# EAGLE design Serial Load Cell converter (EAGLE 7.2.0)
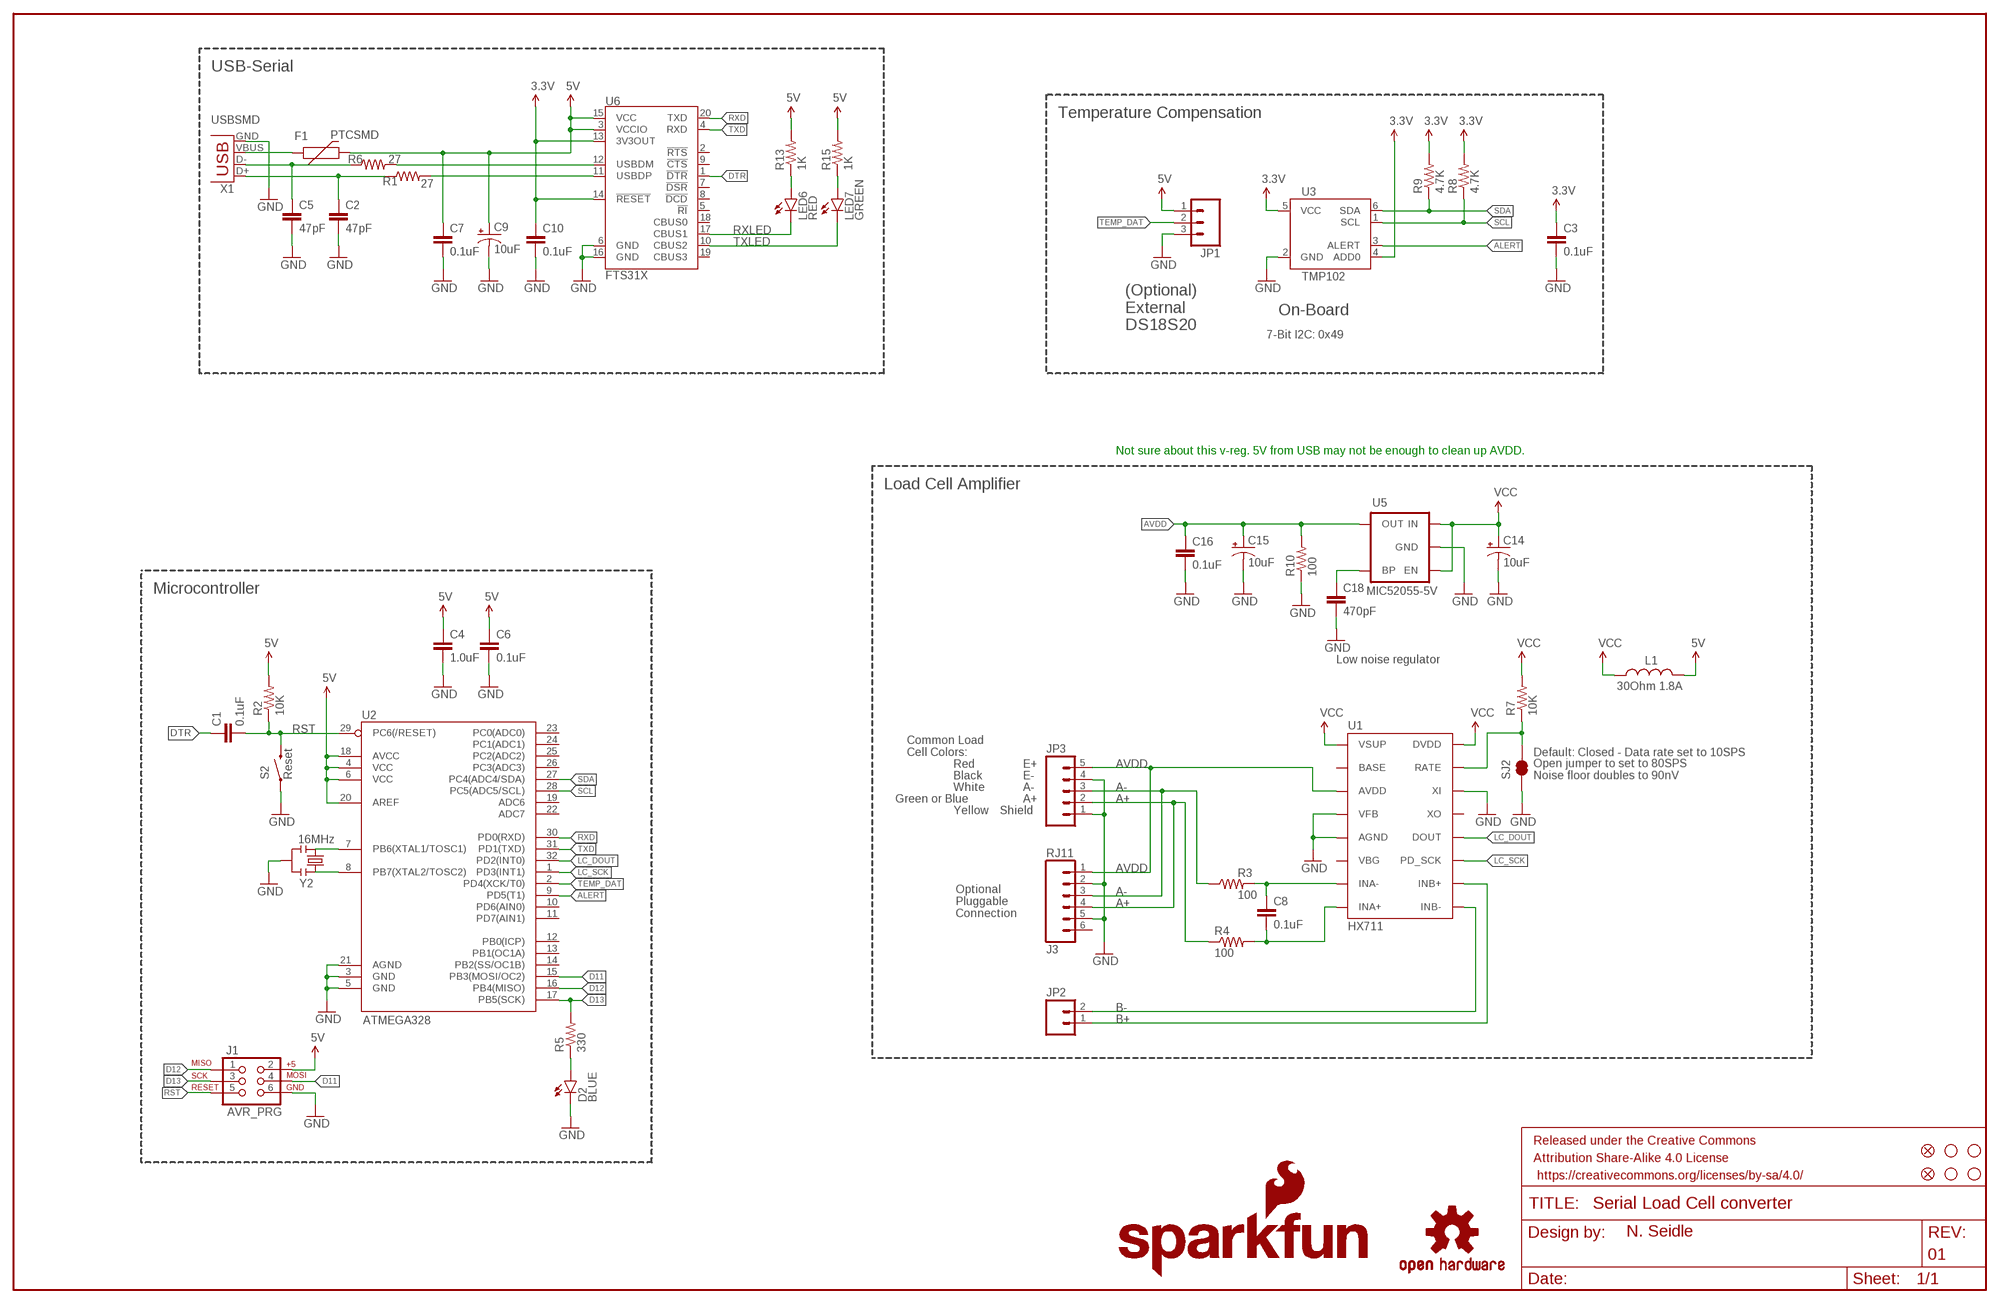
[diagram p0: schematic, sheet 1]

## Parts
C1  0.1uF  0.1UF-25V(+80/-20%)(0603)  [0603-CAP]
C2  47pF  47PF-50V-5%(0603)  [0603-CAP]
C3  0.1uF  0.1UF-25V-5%(0603)  [0603-CAP]
C4  1.0uF  1.0UF-16V-10%(0603)  [0603-CAP]
C5  47pF  47PF-50V-5%(0603)  [0603-CAP]
C6  0.1uF  0.1UF-25V(+80/-20%)(0603)  [0603-CAP]
C7  0.1uF  0.1UF-25V(+80/-20%)(0603)  [0603-CAP]
C8  0.1uF  0.1UF-25V-5%(0603)  [0603-CAP]
C9  10uF  10UF-16V-10%(TANT)  [EIA3216]
C10  0.1uF  0.1UF-25V(+80/-20%)(0603)  [0603-CAP]
C14  10uF  10UF-16V-10%(TANT)  [EIA3216]
C15  10uF  10UF-16V-10%(TANT)  [EIA3216]
C16  0.1uF  0.1UF-25V-5%(0603)  [0603-CAP]
C18  470pF  470PF-50V-5%(0603)SMD  [0603-CAP]
D2  BLUE  LED-BLUE1206  [LED-1206]
F1  PTCSMD  [PTC-1206]
FID1  FIDUCIAL1X2  [FIDUCIAL-1X2]
FID2  FIDUCIAL1X2  [FIDUCIAL-1X2]
FRAME1  FRAME-LEDGER  [CREATIVE_COMMONS]
J1  AVR_PRG  AVR_SPI_PRG_6PTH  [2X3]
J3  RJ11  RJ11-6PTH  [RJ11-6]
JP1  M03PTH  [1X03]
JP2  M02PTH  [1X02]
JP3  M05PTH  [1X05]
L1  30Ohm 1.8A  INDUCTOR30OHM,1.8A  [0603]
LED6  RED  LED-RED1206  [LED-1206]
LED7  GREEN  LED-GREENLARGE  [LED-1206]
LOGO1  SFE_LOGO_NAME_FLAME.1_INCH  [SFE_LOGO_NAME_FLAME_.1]
LOGO2  OSHW-LOGOS  [OSHW-LOGO-S]
LOGO4  SFE_LOGO_NAME_FLAME.1_INCH  [SFE_LOGO_NAME_FLAME_.1]
R1  27  27OHM1/10W1%(0603)  [0603]
R2  10K  10KOHM-1/10W-1%(0603)0603  [0603-RES]
R3  100  100OHM-1/10W-1%(0603)  [0603-RES]
R4  100  100OHM-1/10W-1%(0603)  [0603-RES]
R5  330  330OHM1/10W1%(0603)  [0603-RES]
R6  27  27OHM1/10W1%(0603)  [0603]
R7  10K  10KOHM-1/10W-1%(0603)0603  [0603-RES]
R8  4.7K  4.7KOHM-1/10W-1%(0603)  [0603-RES]
R9  4.7K  4.7KOHM-1/10W-1%(0603)  [0603-RES]
R10  100  100OHM-1/10W-1%(0603)  [0603-RES]
R13  1K  1KOHM-1/10W-1%(0603)  [0603-RES]
R15  1K  1KOHM-1/10W-1%(0603)  [0603-RES]
S2  Reset  SWITCH-MOMENTARY-2SMD  [TACTILE-SWITCH-SMD]
SJ2  JUMPER-PAD-2-NC_BY_TRACE  [PAD-JUMPER-2-NC_BY_TRACE_YES_SILK]
STANDOFF1  STAND-OFF  [STAND-OFF]
STANDOFF2  STAND-OFF  [STAND-OFF]
STANDOFF3  STAND-OFF  [STAND-OFF]
STANDOFF4  STAND-OFF  [STAND-OFF]
U1  HX711  HX711HX711  [SO16]
U2  ATMEGA328  ATMEGA328_SMT  [TQFP32-08]
U3  TMP102  [SOT563]
U5  MIC52055-5V  MIC52055V  [SOT23-5]
U6  FTS31X  FT231XS  [SSOP20_L]
X1  USBSMD  [USB-MINIB]
Y2  16MHz  RESONATOR16MHZ  [RESONATOR-SMD]

## Nets
3.3V [power]: C3.1 C10.1 R8.2 R9.2 U3.4(ADD0) U3.5(VCC) U6.13(3V3OUT) U6.14(!RESET)
5V: C4.1 C6.1 C7.1 C9.A(+) F1.2 J1.2 JP1.1 L1.2 R2.2 R13.2 R15.2 U2.4(VCC) U2.6(VCC) U2.18(AVCC) U2.20(AREF) U6.3(VCCIO) U6.15(VCC)
A+: J3.4 JP3.2 R4.1
A-: J3.3 JP3.3 R3.1
ALERT: U2.9(PD5(T1)) U3.3(ALERT)
AVDD: C15.A(+) C16.1 J3.1 JP3.5 R10.2 U1.3(AVDD) U5.5(OUT)
B+: JP2.1 U1.10(INB+)
B-: JP2.2 U1.9(INB-)
D11: J1.4 U2.15(PB3(MOSI/OC2))
D12: J1.1 U2.16(PB4(MISO))
D13: J1.3 R5.2 U2.17(PB5(SCK))
DTR: C1.1 U6.1(!DTR)
GND [power]: C2.2 C3.2 C4.2 C5.2 C6.2 C7.2 C9.C(-) C10.2 C14.C(-) C15.C(-) C16.2 C18.2 D2.C J1.6 J3.2 J3.5 JP1.3 JP3.1 JP3.4 R10.1 S2.1 SJ2.1 U1.4(VFB) U1.5(AGND) U1.14(XI) U2.3(GND) U2.5(GND) U2.21(AGND) U3.2(GND) U5.2(GND) U6.6(GND) U6.16(GND) X1.GND Y2.2
LC_DOUT: U1.12(DOUT) U2.32(PD2(INT0))
LC_SCK: U1.11(PD_SCK) U2.1(PD3(INT1))
N$1: U2.7(PB6(XTAL1/TOSC1)) Y2.1
N$2: D2.A R5.1
N$3: U2.8(PB7(XTAL2/TOSC2)) Y2.3
N$4: C5.1 R6.1 X1.D-
N$5: LED6.A R13.1
N$6: LED7.A R15.1
N$7: C2.1 R1.1 X1.D+
N$8: R6.2 U6.12(USBDM)
N$9: R7.1 SJ2.2 U1.15(RATE)
N$10: C8.1 R3.2 U1.7(INA-)
N$11: C8.2 R4.2 U1.8(INA+)
N$12: F1.1 X1.VBUS
N$13: R1.2 U6.11(USBDP)
N$15: C18.1 U5.4(BP)
RST: C1.2 J1.5 R2.1 S2.3 U2.29(PC6(/RESET))
RXD: U2.30(PD0(RXD)) U6.20(TXD)
RXLED: LED6.C U6.17(CBUS1)
SCL: R8.1 U2.28(PC5(ADC5/SCL)) U3.1(SCL)
SDA: R9.1 U2.27(PC4(ADC4/SDA)) U3.6(SDA)
TEMP_DAT: JP1.2 U2.2(PD4(XCK/T0))
TXD: U2.31(PD1(TXD)) U6.4(RXD)
TXLED: LED7.C U6.10(CBUS2)
VCC: C14.A(+) L1.1 R7.2 U1.1(VSUP) U1.16(DVDD) U5.1(IN) U5.3(EN)
Unconnected: J3.6 U1.2(BASE) U1.6(VBG) U1.13(XO) U2.10(PD6(AIN0)) U2.11(PD7(AIN1)) U2.12(PB0(ICP)) U2.13(PB1(OC1A)) U2.14(PB2(SS/OC1B)) U2.19(ADC6) U2.22(ADC7) U2.23(PC0(ADC0)) U2.24(PC1(ADC1)) U2.25(PC2(ADC2)) U2.26(PC3(ADC3)) U6.2(!RTS) U6.5(!RI) U6.7(!DSR) U6.8(!DCD) U6.9(!CTS) U6.18(CBUS0) U6.19(CBUS3)

## Notes on the sheet
- USB-Serial
- Temperature Compensation
- On-Board
- (Optional)
  External
  DS18S20
- 7-Bit I2C: 0x49
- Not sure about this v-reg. 5V from USB may not be enough to clean up AVDD.
- Load Cell Amplifier
- Microcontroller
- Low noise regulator
- Common Load
  Cell Colors:
- Default: Closed - Data rate set to 10SPS
- Red | E+
- Black | E-
- Open jumper to set to 80SPS
  Noise floor doubles to 90nV
- White | A-
- Green or Blue | A+
- Yellow | Shield
- Optional
  Pluggable
  Connection

## Library data of the parts
C1 C6 C7 C10 = SparkFun-Capacitors:0.1UF-25V(+80/-20%)(0603): CAP-00810 Ceramic Standard decoupling cap; PROD_ID: CAP-00810
C2 C5 = SparkFun-Capacitors:47PF-50V-5%(0603): CAP-08913; PROD_ID: CAP-08913
C3 C8 C16 = SparkFun-Capacitors:0.1UF-25V-5%(0603): CAP-08604; PROD_ID: CAP-08604
C4 = SparkFun-Capacitors:1.0UF-16V-10%(0603): CAP-00868; PROD_ID: CAP-00868
C9 C14 C15 = SparkFun-Capacitors:10UF-16V-10%(TANT): CAP-00811 1206/EIA-3216 Tantalum capacitor; PROD_ID: CAP-00811
C18 = SparkFun-Capacitors:470PF-50V-5%(0603): CAP-07884; PROD_ID: CAP-07884
D2 = SparkFun-LED:LED-BLUE: Blue LEDs for production use Various blue LEDs stocked by SparkFun production 0603 - DIO-08575 Rebel - DIO-09553 1206 - DIO-09911; PROD_ID: DIO-09911
F1 = SparkFun-PowerIC:PTC: Resettable Fuse PTC Resettable Fuse. Spark Fun Electronics SKU : COM-08357; PROD_ID: RES-11150
FID1 FID2 = SparkFun-Aesthetics:FIDUCIAL: Fiducial Alignment Points Various fiducial points for machine vision alignment.
FRAME1 = SparkFun-Aesthetics:FRAME-LEDGER: Schematic Frame Standard 11x14 US Ledger frame; DESIGNER: N. Seidle; VERSION: 01
J1 = SparkFun-Connectors:AVR_SPI_PRG_6: AVR ISP 6 Pin This is the reduced ISP connector for AVR programming. Common on Arduino. This footprint will take up less PCB space and can be used with a 10-pin to 6-pin adapter such as SKU: BOB-08508 **Special note about "TEST_POINT" package. The stop mask is on the top side, so if you want your programming test points to be on the bottom of your board, make sure to place this package on the bottom side of the board. This also ensure that the orientation to program from the bottom side will be correct.
J3 = SparkFun-Connectors:RJ11-6: RJ11 Jack Simple 6 pin RJ11 jack. Commonly found on CAT3 devices and Microchip programmers. SKU: PRT-00132; PROD_ID: CONN-08590
JP1 = SparkFun-Connectors:M03: Header 3 Standard 3-pin 0.1" header. Use with straight break away headers (SKU : PRT-00116), right angle break away headers (PRT-00553), swiss pins (PRT-00743), machine pins (PRT-00117), and female headers (PRT-00115). Molex polarized connector foot print use with SKU : PRT-08232 with associated crimp pins and housings.
JP2 = SparkFun-Connectors:M02: Standard 2-pin 0.1" header. Use with - straight break away headers ( PRT-00116) - right angle break away headers (PRT-00553) - swiss pins (PRT-00743) - machine pins (PRT-00117) - female headers (PRT-00115) Molex polarized connector foot print use with: PRT-08233 with associated crimp pins and housings. 2.54_SCREWTERM for use with PRT-10571. 3.5mm Screw Terminal footprints for PRT-08084 5mm Screw Terminal footprints for use with PRT-08432
JP3 = SparkFun-Connectors:M05: Header 5 Standard 5-pin 0.1" header. Use with straight break away headers (SKU : PRT-00116), right angle break away headers (PRT-00553), swiss pins (PRT-00743), machine pins (PRT-00117), and female headers (PRT-00115). Molex polarized connector foot print use with SKU : PRT-08230 with associated crimp pins and housings.
L1 = SparkFun-Passives:INDUCTOR: Inductors Basic Inductor/Choke - 0603 and 1206. Footprints are not proven and vary greatly between part numbers. SRN6045- 33uH, 20% 1.4A SDR0403-560KL - 56uH, 10%, 500mA RMS/740mA peak; PROD_ID: RES-07859
LED6 = SparkFun-LED:LED-RED: Assorted Red LEDs LilyPad 1206- DIO-09912 1206- DIO-00809 0603- DIO-00819; PROD_ID: DIO-00809
LED7 = SparkFun-LED:LED-GREEN: Various green LEDs Green LEDs used in SFE Production 0603- DIO-00821 LARGE- DIO-00862 LILYPAD- DIO-09910; PROD_ID: DIO-00862
LOGO1 LOGO4 = SparkFun-Aesthetics:SFE_LOGO_NAME_FLAME: SFE Logo, name and flame This is the SparkFun full logo. The logo on the schematic will always be the same size; the package variant is the height of the flame part of the logo. Default layer for the logo on the board is tSilk.
LOGO2 = SparkFun-Aesthetics:OSHW-LOGO: Open Source Hardware Logo This logo indicates the piece of hardware it is found on incorporates a OSHW license and/or adheres to the definition of open source hardware found here: http://freedomdefined.org/OSHW
R1 R6 = SparkFun-Resistors:27OHM1/10W1%(0603): RES-09334; PROD_ID: RES-09334
R2 R7 = SparkFun-Resistors:10KOHM-1/10W-1%(0603): RES-00824; PROD_ID: RES-00824
R3 R4 R10 = SparkFun-Resistors:100OHM-1/10W-1%(0603): RES-07863; PROD_ID: RES-07863
R5 = SparkFun-Resistors:330OHM1/10W1%(0603): RES-00818; PROD_ID: RES-00818
R8 R9 = SparkFun-Resistors:4.7KOHM-1/10W-1%(0603): RES-07857; PROD_ID: RES-07857
R13 R15 = SparkFun-Resistors:1KOHM-1/10W-1%(0603): RES-07856; PROD_ID: RES-07856
S2 = SparkFun-Electromechanical:SWITCH-MOMENTARY-2: Various NO switches- pushbuttons, reed, etc; PROD_ID: SWCH-08247
SJ2 = SparkFun-Passives:JUMPER-PAD-2-NC_BY_TRACE
STANDOFF1-STANDOFF4 = SparkFun-Electromechanical:STAND-OFF: #4 Stand Off This is the mechanical footprint for a #4 phillips button head screw. Use the keepout ring to avoid running the screw head into surrounding components. SKU : PRT-00447
U1 = Testing:HX711; PROD_ID: IC-12445
U2 = SparkFun-DigitalIC:ATMEGA328_SMT: 32-Pin Atmega328 part Commonly used on Arduino compatible boards Available in QFP and QFN packages TQFP is IC-09069 QFN is non-stock; PROD_ID: IC-09069; VALUE: ATMEGA328P
U3 = SparkFun-Sensors:TMP102: I2C degC temp sensor; PROD_ID: IC-09303
U5 = SparkFun-PowerIC:MIC5205: MIC5205 150mA vreg 3.3V - VREG-00822 5V - VREG-00823; PROD_ID: VREG-00823
U6 = SparkFun-DigitalIC:FT231X: FTDI FT231X Full Speed USB to Full-handshake UART This USB2.0 Full Speed IC offers a compact bridge to full handshake UART interfaces. The device is a UART, capable of operating up to 3MBaud, with low power consumption (8mA). The FT231X includes the complete FT-X series feature set and enables USB to be added into a system design quickly and easily over a UART interface.; PROD_ID: IC-11524; VALUE: FTS31XS-U
X1 = SparkFun-Connectors:USB: USB Connectors USB-B-PTH is fully proven SKU : PRT-00139/CONN-08278 USB-miniB is fully proven SKU : PRT-00587 USB-A-PCB is untested. USB-A-H is throughly reviewed, but untested. Spark Fun Electronics SKU : PRT-00437 USB-B-SMT is throughly reviewed, but untested. Needs silkscreen touching up. USB-A-S has not been used/tested USB-MB-H has not been used/tested USB-MICROB has been used. CONN-09505; PROD_ID: CONN-08193
Y2 = SparkFun-FreqCtrl:RESONATOR: Resonator Small SMD resonator. Used, eg, on the Arduino Pro/ Pro Mini boards. 8MHz- XTAL-08895 16MHz- XTAL-08900; PROD_ID: XTAL-08900; VALUE: 16MHZ

## Net classes
1 power: width 0.203 mm

## Board
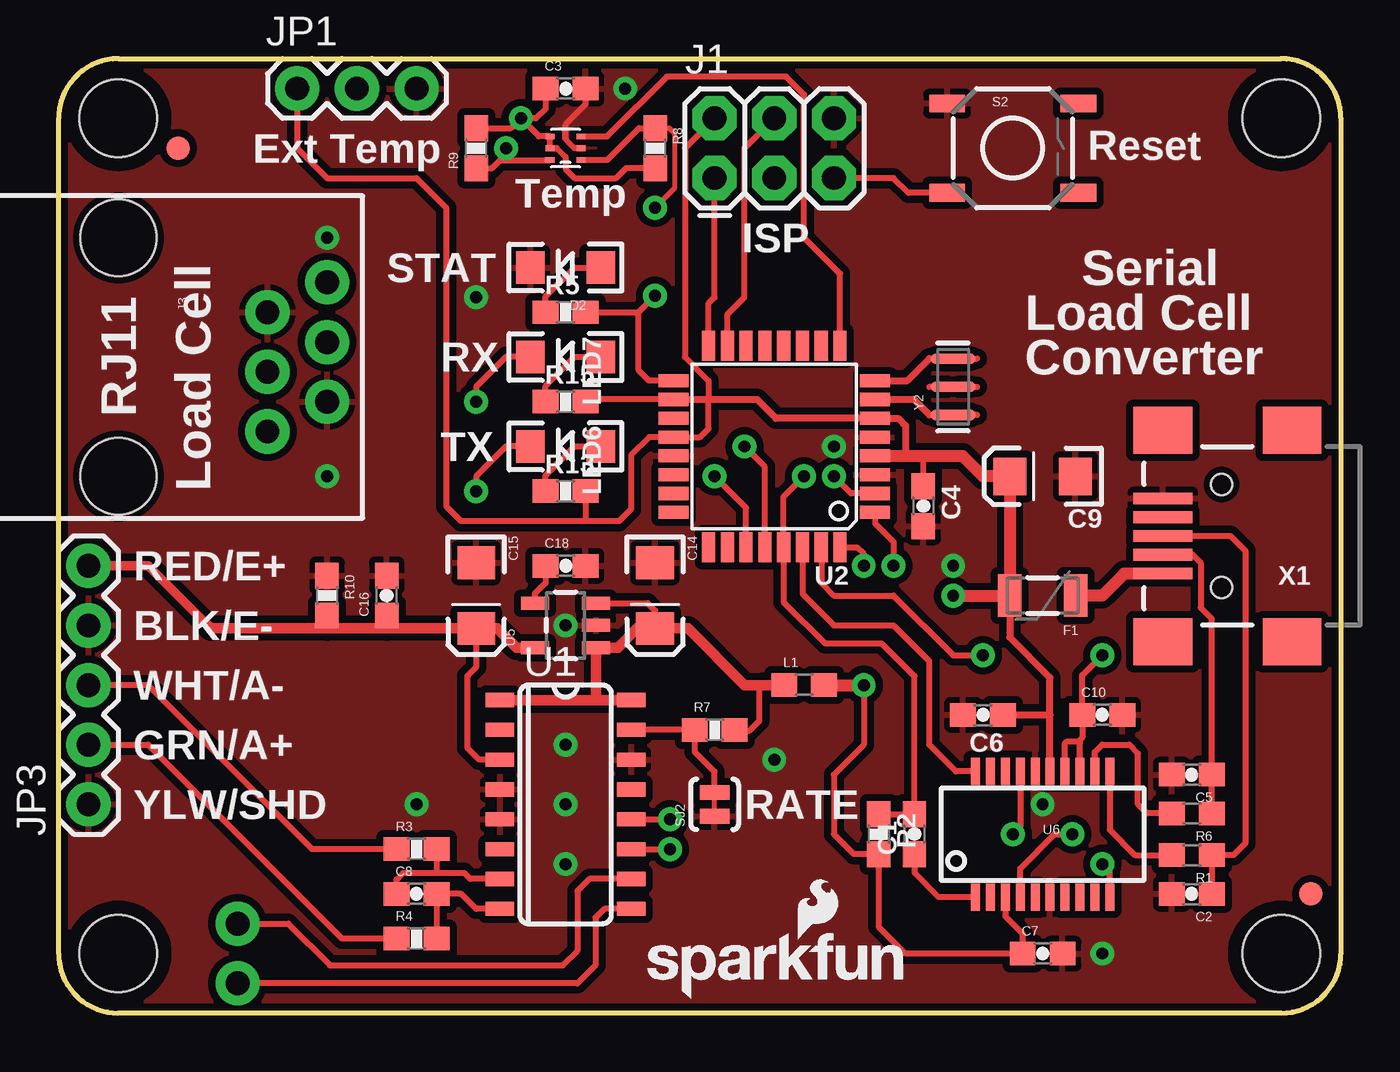
[diagram p1: board, top side]
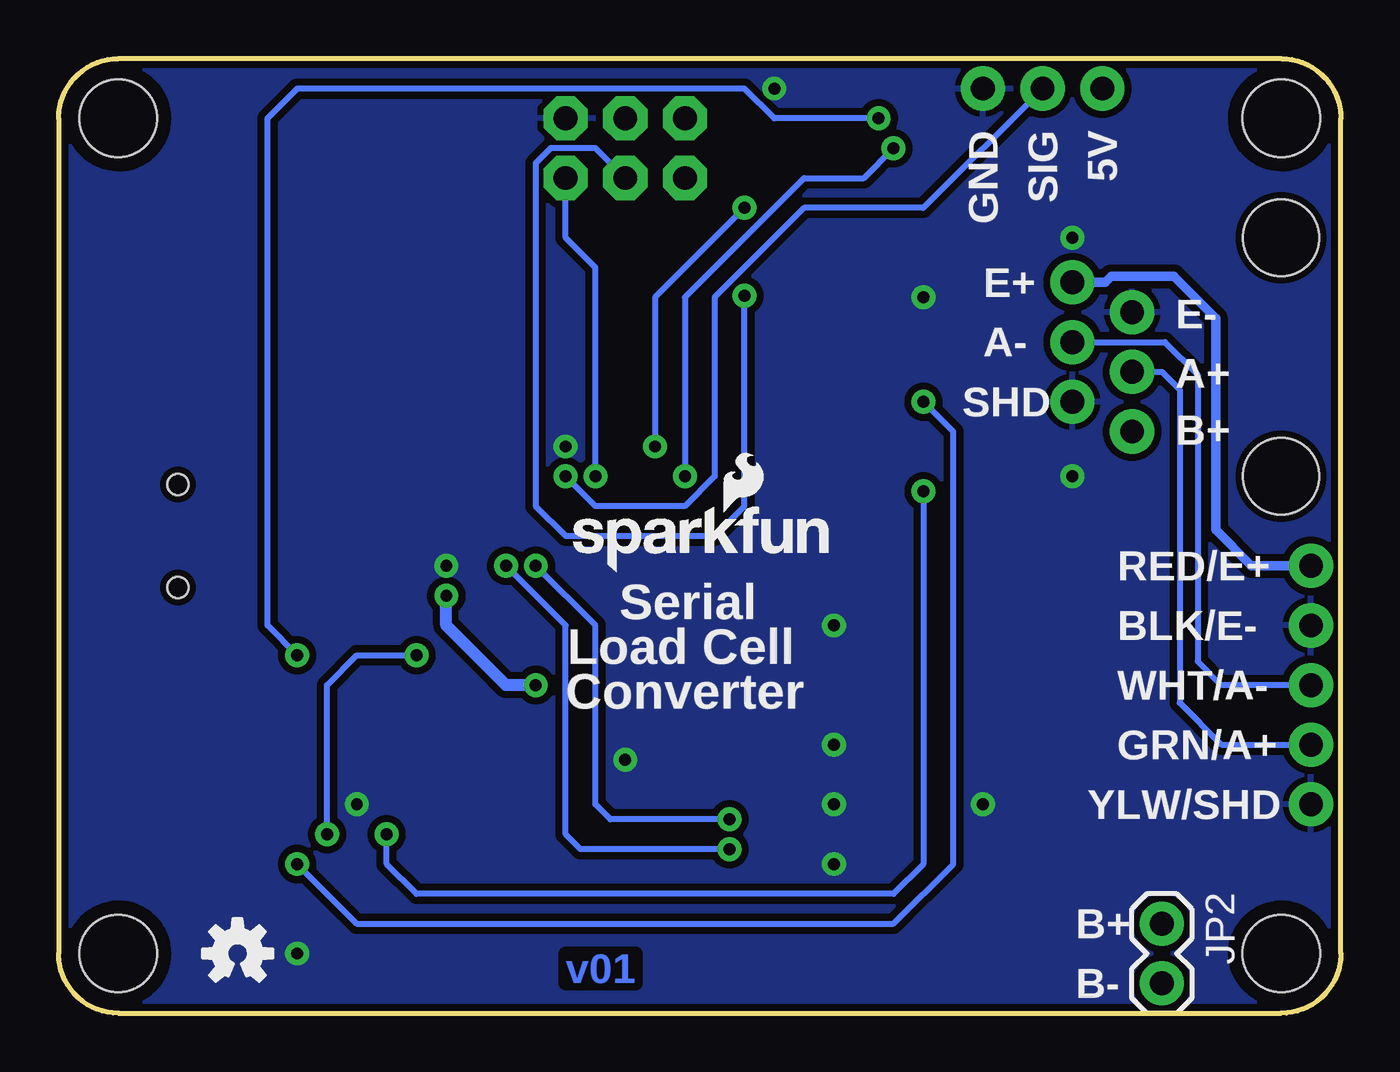
[diagram p2: board, bottom side, seen from below]

Size 54.61 x 40.64 mm. Coordinates in mm from the lower left corner, seen from the top.
Outline: 52.07,0 2.54,0 arc-90 0,2.54 0,38.1 arc-90 2.54,40.64 52.07,40.64 arc-90 54.61,38.1 54.61,2.54 arc-90 52.07,0
Copper layers (1*16): Top 0.035mm / dielectric 1.5mm / Bottom 0.035mm
Design rules "SparkFun-2-layer *": minimum track width 7mil, minimum drill 15mil, track to track 8mil, track to pad 8mil, pad to pad 8mil, via to via 8mil, smd to smd 8mil, copper to edge 8mil, drill to drill 8mil, minimum pad ring 12mil, minimum via ring 10mil, stop-mask expansion 4mil, vias tented up to drill 20mil, thermal gap 10mil

### Footprints (pad centres in the part's own frame; a part is rotated, then mirrored left to right if it is on the bottom)
0603-CAP = smd 1.1 x 1: 1 -0.85,0; 2 0.85,0
EIA3216 = smd 1.4 x 1.6: A 1.4,0; C -1.4,0
LED-1206 = smd 1.2 x 1.4: A -1.5,0; C 1.5,0
PTC-1206 = smd 1 x 1.8: 1 -1.4,0; 2 1.4,0
FIDUCIAL-1X2 = smd 1 x 1: 1 0,0
2X3 = drill 1.016 pad 1.88 octagon: 1 0,0; 2 0,2.54; 3 2.54,0; 4 2.54,2.54; 5 5.08,0; 6 5.08,2.54
RJ11-6 = drill 1.016 pad 1.88: 1 -3.175,8.89; 2 -1.905,6.35; 3 -0.635,8.89; 4 0.635,6.35; 5 1.905,8.89; 6 3.175,6.35 | hole 3.251: -5.08,0; 5.08,0
1X03 = drill 1.016 pad 1.88: 1 0,0; 2 2.54,0; 3 5.08,0
1X02 = drill 1.016 pad 1.88: 1 0,0; 2 2.54,0
1X05 = drill 1.016 pad 1.88: 1 0,0; 2 2.54,0; 3 5.08,0; 4 7.62,0; 5 10.16,0
0603 = smd 1.1 x 1: 1 -0.85,0; 2 0.85,0
0603-RES = smd 1.1 x 1: 1 -0.85,0; 2 0.85,0
TACTILE-SWITCH-SMD = smd 1.524 x 0.762: 1 -2.794,1.905; 2 2.794,1.905; 3 -2.794,-1.905; 4 2.794,-1.905
PAD-JUMPER-2-NC_BY_TRACE_YES_SILK = smd 0.635 x 1.27: 1 -0.508,0; 2 0.508,0
STAND-OFF = hole 3.302: 0,0
SO16 = smd 0.6 x 1.2: 1 -4.445,-2.8; 2 -3.175,-2.8; 3 -1.905,-2.8; 4 -0.635,-2.8; 5 0.635,-2.8; 6 1.905,-2.8; 7 3.175,-2.8; 8 4.445,-2.8; 9 4.445,2.8; 10 3.175,2.8; 11 1.905,2.8; 12 0.635,2.8; 13 -0.635,2.8; 14 -1.905,2.8; 15 -3.175,2.8; 16 -4.445,2.8
TQFP32-08 = smd 1.27 x 0.559: 1 -4.293,2.8; 2 -4.293,2; 3 -4.293,1.2; 4 -4.293,0.4; 5 -4.293,-0.4; 6 -4.293,-1.2; 7 -4.293,-2; 8 -4.293,-2.8; 17 4.293,-2.8; 18 4.293,-2; 19 4.293,-1.2; 20 4.293,-0.4; 21 4.293,0.4; 22 4.293,1.2; 23 4.293,2; 24 4.293,2.8 | smd 0.559 x 1.27: 9 -2.8,-4.293; 10 -2,-4.293; 11 -1.2,-4.293; 12 -0.4,-4.293; 13 0.4,-4.293; 14 1.2,-4.293; 15 2,-4.293; 16 2.8,-4.293; 25 2.8,4.293; 26 2,4.293; 27 1.2,4.293; 28 0.4,4.293; 29 -0.4,4.293; 30 -1.2,4.293; 31 -2,4.293; 32 -2.8,4.293
SOT563 = smd 0.25 x 0.4: 1 -0.5,-0.66; 2 0,-0.66; 3 0.5,-0.66; 4 0.5,0.66; 5 0,0.66; 6 -0.5,0.67
SOT23-5 = smd 0.55 x 1.2: 1 -0.95,-1.3; 2 0,-1.3; 3 0.95,-1.3; 4 0.95,1.3; 5 -0.95,1.3
SSOP20_L = smd 0.381 x 1.143: 1 -2.857,-2.68; 2 -2.223,-2.68; 3 -1.587,-2.68; 4 -0.953,-2.68; 5 -0.318,-2.68; 6 0.318,-2.68; 7 0.953,-2.68; 8 1.587,-2.68; 9 2.223,-2.68; 10 2.857,-2.68; 11 2.857,2.68; 12 2.223,2.68; 13 1.587,2.68; 14 0.953,2.68; 15 0.318,2.68; 16 -0.318,2.68; 17 -0.953,2.68; 18 -1.587,2.68; 19 -2.223,2.68; 20 -2.857,2.68
USB-MINIB = smd 2.5 x 0.5: D+ 2.5,0; D- 2.5,0.8; GND 2.5,-1.6; ID 2.5,-0.8; VBUS 2.5,1.6 | smd 2.5 x 2: MTN1 -3,4.5; MTN2 2.5,4.5; MTN3 -3,-4.5; MTN4 2.5,-4.5 | hole 0.9: 0,2.2; 0,-2.2
RESONATOR-SMD = smd 0.45 x 1.905: 1 -1.2,0; 2 0,0; 3 1.2,0

### Placement (x,y rotation side)
C1  36.45,7.62 90 top
C2  48.26,5.08 180 top
C3  21.59,39.37 0 top
C4  36.83,21.59 270 top
C5  48.26,10.16 180 top
C6  39.37,12.7 180 top
C7  41.91,2.54 0 top
C8  15.24,5.08 0 top
C9  41.91,22.86 180 top
C10  44.45,12.7 0 top
C14  25.4,17.78 270 top
C15  17.78,17.78 270 top
C16  13.97,17.78 90 top
C18  21.59,19.05 0 top
D2  21.59,31.75 180 top
F1  41.91,17.78 180 top
FID1  53.34,5.08 0 top
FID2  5.08,36.83 0 top
FRAME1  3.81,-7.62 0 top  (outside the outline)
J1  27.94,35.56 0 top
J3  2.54,27.94 270 top
JP1  10.16,39.37 0 top
JP2  7.62,3.81 270 bottom
JP3  1.27,8.89 90 top
L1  31.75,13.97 0 top
LED6  21.59,24.13 180 top
LED7  21.59,27.94 180 top
LOGO1  24.64,0.51 0 top
LOGO2  46.99,2.54 0 bottom
LOGO4  33.15,18.67 0 bottom
R1  48.26,6.73 180 top
R2  34.92,7.62 270 top
R3  15.24,6.99 0 top
R4  15.24,3.17 0 top
R5  21.59,29.84 0 top
R6  48.26,8.51 180 top
R7  27.94,12.06 0 top
R8  25.4,36.83 270 top
R9  17.78,36.83 90 top
R10  11.43,17.78 270 top
R13  21.59,22.23 0 top
R15  21.59,26.04 0 top
S2  40.64,36.83 0 top
SJ2  27.94,8.89 90 top
STANDOFF1  52.07,38.1 0 top
STANDOFF2  52.07,2.54 0 top
STANDOFF3  2.54,2.54 0 top
STANDOFF4  2.54,38.1 0 top
U1  21.59,8.89 270 top
U2  30.48,24.13 180 top
U3  21.59,36.83 90 top
U5  21.59,16.51 90 top
U6  41.91,7.62 0 top
X1  49.53,20.32 180 top
Y2  38.1,26.67 90 top

### Tracks (layer width: path | path; a pad name or v marks a point on that pad's centre or on a via)
3.3V  (via drill 0.51)
  Top 0.203: 21.21,36.83 21.59,36.45
  Top 0.254: 21.21,36.83 U3.5 U3.4 20.45,37.33 v19.68,38.1 | 21.59,36.45 21.59,35.94 21.97,35.56 23.75,35.56 24.17,35.98 R8.2 | R9.2 19.27,37.68 v19.68,38.1 | C3.1 20.74,38.52 20.32,38.1 v19.68,38.1 | v44.45,15.24 43.6,14.39 C10.1 43.6,11.72 43.43,11.56 | U6.14 42.86,11.49 42.93,11.56 43.43,11.56 | U6.13 43.5,11.49 43.43,11.56
  Bottom 0.254: v19.68,38.1 24.13,38.1 25.4,39.37 44.45,39.37 45.72,38.1 45.72,16.51 v44.45,15.24
5V  (via drill 0.51)
  Top 0.254: U2.18 22.54,26.13 R15.2 | C4.1 36.83,23.73 | JP1.1 10.16,36.83 11.43,35.56 15.24,35.56 16.51,34.29 16.51,21.59 17.14,20.95 22.48,20.95 | J1.2 26.67,36.83 26.67,27.94 27.69,26.92 27.69,26.13 27.69,24.89 27.32,24.53 U2.20 25.16,24.53 24.38,23.75 24.38,21.46 23.88,20.95 22.48,20.95 | R13.2 22.44,20.99 22.48,20.95 | v34.29,13.97 34.29,11.43 33.02,10.16 33.02,7.62 33.87,6.77 R2.2 34.92,3.68 36.07,2.54 C7.1 41.06,3.39 40.32,4.13 U6.3
  Top 0.305: U2.18 27.69,26.13 29.75,26.13 30.55,25.33 U2.6 35.76,25.33 36.07,25.02 36.07,23.73 | F1.2 40.51,16 42.23,14.29 42.23,12.7 | U6.15 42.23,12.7 | C6.1 42.23,12.7
  Top 0.406: L1.2 33.02,13.97
  Top 0.508: U2.4 36.07,23.73 36.83,23.73 38.5,23.73 39.37,22.86 C9.A F1.2 v38.1,17.78 | 33.02,13.97 v34.29,13.97
  Bottom 0.508: v34.29,13.97 35.56,13.97 38.1,16.51 v38.1,17.78
A+
  Top 0.254: R4.1 12.06,3.17 3.81,11.43 JP3.2
  Bottom 0.254: J3.4 7.62,27.3 6.86,26.54 6.86,13.21 5.08,11.43 JP3.2
A-
  Top 0.254: R3.1 10.79,6.99 3.81,13.97 JP3.3
  Bottom 0.254: J3.3 7.49,28.57 6.1,27.18 6.1,14.99 5.08,13.97 JP3.3
ALERT
  Top 0.254: U2.9 33.28,31.49 31.75,33.02 31.75,39.12 30.99,39.88 25.91,39.88 23.36,37.33 U3.3
AVDD
  Top 0.254: U1.3 17.91,10.79 17.4,11.3 17.4,14.35 17.78,14.73 C15.A
  Top 0.406: 6.35,16.51 3.81,19.05 JP3.5
  Top 0.457: U5.5 19.49,15.56 18.67,16.38 C15.A 13.97,16.38 | 13.97,16.38 11.43,16.38 | 11.43,16.38 6.48,16.38 6.35,16.51 | R10.2 11.43,16.38 | C16.1 13.97,16.38
  Bottom 0.406: J3.1 10.03,31.11 9.78,31.37 7.11,31.37 5.33,29.59 5.33,20.57 3.81,19.05 JP3.5
B+
  Top 0.254: JP2.1 9.78,3.81 11.56,2.03 21.46,2.03 22.1,2.67 22.1,5.21 22.61,5.71 U1.10
B-
  Top 0.254: U1.9 23.24,4.45 22.86,4.06 22.86,2.03 22.1,1.27 JP2.2
D11
  Top 0.254: U2.15 28.48,29.75 29.21,30.48 29.21,36.83 J1.4
D12
  Top 0.254: U2.16 27.68,30.22 27.94,30.48 J1.1
D13  (via drill 0.51)
  Top 0.254: U2.17 25.14,26.93 24.7,27.37 24.7,29.84 | 24.7,29.84 v25.4,30.54 | R5.2 24.7,29.84
  Bottom 0.254: J1.3 31.75,36.83 33.66,36.83 34.29,36.2 34.29,21.59 33.02,20.32 26.67,20.32 25.4,21.59 v25.4,30.54
DTR
  Top 0.254: U6.1 37.48,4.94 36.45,5.97 C1.1
GND  (via drill 0.51)
  Top 0.203: 21.97,36.83 21.59,37.21
  Top 0.254: U3.2 21.97,36.83 | 21.59,37.21 21.59,37.85 22.44,38.7 C3.2
  other vias: 24.13,39.37 11.43,33.02 17.78,30.48 21.59,16.51 21.59,11.43 21.59,8.89 21.59,6.35 15.24,8.89 30.48,10.79 11.43,22.86 33.02,24.13 38.1,19.05 41.91,8.89 44.45,2.54
  pour Top (isolate 0.305, rank 6): 55.88,40.64 0,40.64 0,0 55.88,0
  pour Bottom (isolate 0.305, rank 6): 55.88,40.64 0,40.64 0,0 55.88,0
LC_DOUT  (via drill 0.51)
  Top 0.254: U1.12 v26.04,8.26 | U2.32 34.01,19.84 34.29,19.56 v34.29,19.05
  Bottom 0.254: v26.04,8.26 31.11,8.26 31.75,8.89 31.75,16.51 v34.29,19.05
LC_SCK  (via drill 0.51)
  Top 0.254: U1.11 v26.04,6.99 | U2.1 34.77,20.85 35.56,20.07 v35.56,19.05
  Bottom 0.254: v35.56,19.05 33.02,16.51 33.02,7.62 32.38,6.99 v26.04,6.99
N$1
  Top 0.305: U2.7 36.42,26.13 37.08,25.47
N$2
  Top 0.254: R5.1 20.74,30.52 21.97,31.75 D2.A
N$3
  Top 0.305: U2.8 36.14,26.93 37.08,27.87
N$4
  Top 0.254: R6.1 C5.1 49.11,16.8 48.64,17.27 48.64,19.18 48.3,19.52 X1.D-
N$5
  Top 0.254: R13.1 20.74,22.9 21.97,24.13 LED6.A
N$6
  Top 0.254: R15.1 20.74,26.71 21.97,27.94 LED7.A
N$7
  Top 0.254: X1.D+ 49.91,20.32 50.55,19.68 50.55,7.24 50.04,6.73 R1.1 C2.1
N$8
  Top 0.254: R6.2 46.35,8.51 45.97,8.89 45.97,11.05 45.59,11.43 44.45,11.43 44.13,11.11 U6.12
N$9
  Top 0.254: SJ2.2 27.94,10.29 27.09,11.14 R7.1 U1.15
N$10
  Top 0.254: C8.1 14.39,5.69 14.67,5.97 16.13,5.97 | U1.7 17.53,5.71 17.27,5.97 16.13,5.97 | R3.2 16.09,6.01 16.13,5.97
N$11
  Top 0.254: R4.2 C8.2 17.14,5.08 17.78,4.45 U1.8
N$12
  Top 0.508: X1.VBUS 45.39,18.72 44.45,17.78 F1.1
N$13
  Top 0.254: U6.11 44.77,7.81 45.85,6.73 R1.2
N$15
  Top 0.254: U5.4 20.29,17.88 20.74,18.33 C18.1
RST  (via drill 0.51)
  Top 0.254: v31.75,22.86 30.88,21.99 U2.29 30.88,17.51 32.64,15.75 35.05,15.75 36.45,14.35 C1.2 R2.1 | S2.3 36.2,34.92 35.56,35.56 J1.5
  Bottom 0.254: v31.75,22.86 31.75,31.75 33.02,33.02 J1.5
RXD
  Top 0.254: U2.30 31.68,17.85 33.02,16.51 35.56,16.51 37.08,14.99 37.08,11.43 38.21,10.3 U6.20
RXLED  (via drill 0.51)
  Top 0.254: LED6.C 19.05,24.13 17.78,22.86 v17.78,22.23 | U6.17 40.96,7.94 v40.64,7.62
  Bottom 0.254: v17.78,22.23 17.78,6.35 19.05,5.08 39.37,5.08 40.64,6.35 v40.64,7.62
SCL  (via drill 0.51)
  Top 0.203: R8.1 26.01,37.68 26.23,37.47 26.23,35.12 v25.4,34.29
  Top 0.254: U2.28 30.08,23.26 v29.21,24.13 | U3.1 23.38,36.33 24.73,37.68 R8.1
  Bottom 0.254: v29.21,24.13 29.21,30.48 v25.4,34.29
SDA  (via drill 0.51)
  Top 0.254: U2.27 29.28,21.52 v27.94,22.86 | R9.1 18.45,35.98 18.8,36.32 19.05,36.32 | 19.05,36.32 U3.6 | v19.05,36.83 19.05,36.32
  Bottom 0.254: v27.94,22.86 27.94,30.48 22.86,35.56 20.32,35.56 v19.05,36.83
TEMP_DAT  (via drill 0.51)
  Top 0.254: U2.2 33.75,22.13 v33.02,22.86
  Bottom 0.254: v33.02,22.86 31.75,21.59 27.94,21.59 26.67,22.86 26.67,30.48 22.86,34.29 17.78,34.29 JP1.2
TXD  (via drill 0.51)
  Top 0.254: U2.31 32.48,18.32 33.02,17.78 35.56,17.78 38.1,15.24 v39.37,15.24 | U6.4 40.96,6.16 42.42,7.62 v43.18,7.62
  Bottom 0.254: v43.18,7.62 43.18,13.97 41.91,15.24 v39.37,15.24
TXLED  (via drill 0.51)
  Top 0.254: LED7.C 19.05,27.94 17.78,26.67 v17.78,26.04 | U6.10 44.77,6.03 v44.45,6.35
  Bottom 0.254: v17.78,26.04 16.51,24.77 16.51,6.35 19.05,3.81 41.91,3.81 v44.45,6.35
VCC
  Top 0.254: U5.3 25.09,17.46 25.4,17.14 C14.A | R7.2 28.79,12.03 29.43,12.03 29.84,12.45 29.84,13.84 29.97,13.97
  Top 0.457: U1.1 22.86,13.34 | 22.86,13.34 U1.16 | L1.1 29.97,13.97 29.21,13.97 26.8,16.38 C14.A 24.64,16.38 23.82,15.56 U5.1 22.89,13.37 22.86,13.34

### Text on the board
Bottom: v01
tPlace: Ext Temp | Reset | Temp | ISP | STAT | Serial | Load Cell | RX | Converter | RJ11 | TX | Load Cell | RED/E+ | BLK/E- | WHT/A- | GRN/A+ | YLW/SHD | RATE | N. Seidle
bPlace: 5V | SIG | GND | E+ | E- | A- | A+ | SHD | B+ | RED/E+ | Serial | BLK/E- | Load Cell | WHT/A- | Converter | GRN/A+ | YLW/SHD | B+ | B-
tNames: Casey Kuhns